# EAGLE design Line sensors (EAGLE 9.4.1)
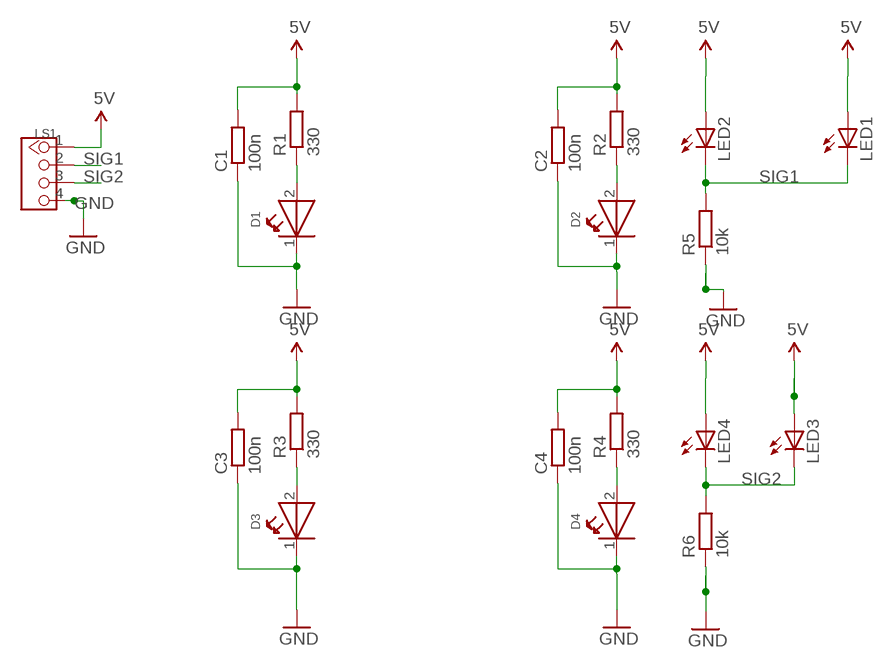
[diagram p0: schematic, sheet 1]

## Parts
C1  100n  R-EU_M0805  [M0805]
C2  100n  R-EU_M0805  [M0805]
C3  100n  R-EU_M0805  [M0805]
C4  100n  R-EU_M0805  [M0805]
D1  WL-SMTW-150141AS73100-A  [3528-2PIN]
D2  WL-SMTW-150141AS73100-A  [3528-2PIN]
D3  WL-SMTW-150141AS73100-A  [3528-2PIN]
D4  WL-SMTW-150141AS73100-A  [3528-2PIN]
LED1  LED3MM  [LED3MM]
LED2  LED3MM  [LED3MM]
LED3  LED3MM  [LED3MM]
LED4  LED3MM  [LED3MM]
LS1  TWIG-4P-2.0-2.0  [4P-2.0]
R1  330  R-EU_M0805  [M0805]
R2  330  R-EU_M0805  [M0805]
R3  330  R-EU_M0805  [M0805]
R4  330  R-EU_M0805  [M0805]
R5  10k  R-EU_M0805  [M0805]
R6  10k  R-EU_M0805  [M0805]

## Nets
5V: C1.2 C2.2 C3.2 C4.2 LED1.A LED2.A LED3.A LED4.A LS1.1 R1.2 R2.2 R3.2 R4.2
GND: C1.1 C2.1 C3.1 C4.1 D1.1(K) D2.1(K) D3.1(K) D4.1(K) LS1.4 R5.1 R6.1
N$3: D1.2(A) R1.1
N$4: D2.2(A) R2.1
N$13: D3.2(A) R3.1
N$16: D4.2(A) R4.1
SIG1: LED1.K(C) LED2.K(C) LS1.2 R5.2
SIG2: LED3.K(C) LED4.K(C) LS1.3 R6.2

## Library data of the parts
C1-C4 R1-R6 = resistor:R-EU_: RESISTOR, European symbol
D1-D4 = Wurth_Elektronik_Optoelectronics_rev15b:WL-SMTW: SMD Side view mono-color round Characteristics Low power consumption High reliability Low current requirement No UV/IR radiation Wide viewing angle Excelllent for edge lighting displays and backlighting indicators Ideal for miniature applications PBC high-usage Compatible with automatic placement equipment Applications Backlighting for LCD Sidelighting applications Indicator and backlighting for telecommunication Backlighting for symbol, switch and dashboard General use <http://katalog.we-online.de/media/images/eipal/WL-SMTW_pf2.jpg> Details see: http://katalog.we-online.de/en/led/WL-SMTW?m Updated: 2015-04-10 2015 (C) Wurth Elektronik; COMPANY-URL: http://www.we-online.de; CREATED-BY: Christin Otto; CREATED-DATE: APR 2013; DATASHEET-URL: http://katalog.we-online.de/en/led/WL-SMTW?m=t&sq=smtw&sp=&sp=http%3A%2F%2Fwww.we-online.de%2Fweb%2Fen%2Felectronic_components%2Fsearchpage_PBS.php%3Fsearch%3Dsmtw; MANUFACTURER: Würth Elektronik eiSos GmbH
LED1-LED4 = SparkFun:LED: LEDs Standard schematic elements and footprints for 5mm, 3mm, 1206, and 0603 sized LEDs. 5mm - Spark Fun Electronics SKU : COM-00529 (and others)
LS1 = Connector:TWIG-4P-2.0

## Board
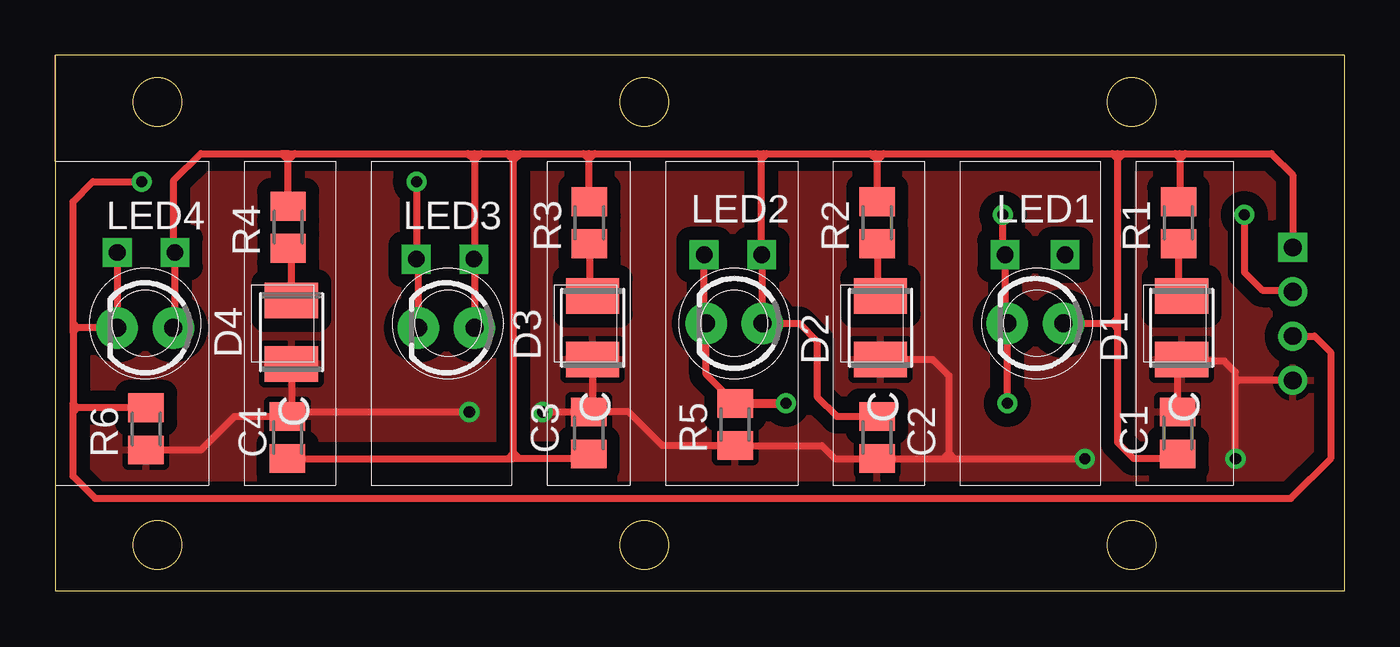
[diagram p1: board, top side]
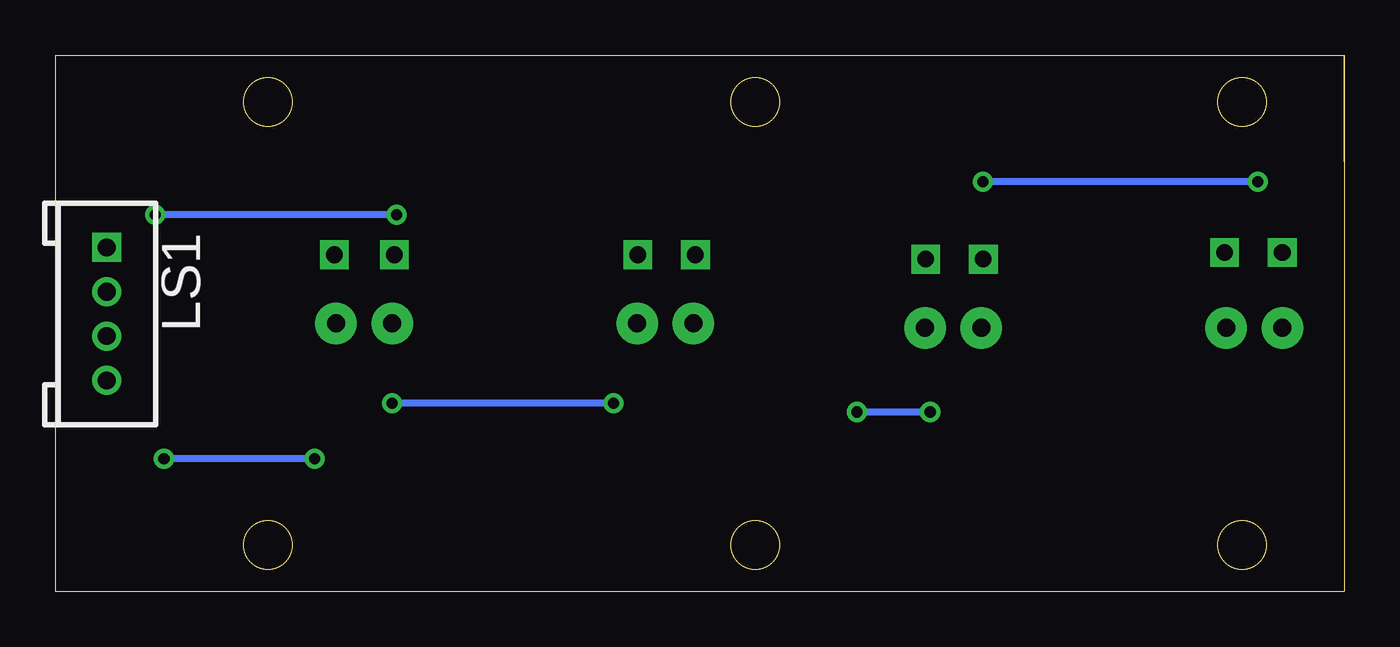
[diagram p2: board, bottom side, seen from below]

Size 58.2 x 24.19 mm. Coordinates in mm from the lower left corner, seen from the top.
Outline: 0,0 58.2,0 58.2,24.19 0,24.19
Outline: 0,24.19 0,0
Outline: 0,19.41 0,24.19
Outline: 53.2,0 0,0
Outline: 53.2,24.19 0,24.19
Outline: circle at 4.6,2.09 radius 1.1
Outline: circle at 48.6,22.09 radius 1.1
Outline: circle at 26.6,22.09 radius 1.1
Outline: circle at 4.6,22.09 radius 1.1
Outline: circle at 48.6,2.09 radius 1.1
Outline: circle at 26.6,2.09 radius 1.1
Outline: circle at 4.6,2.09 radius 1.1
Outline: circle at 4.6,22.09 radius 1.1
Outline: circle at 4.6,2.09 radius 1.1
Outline: circle at 48.6,22.09 radius 1.1
Outline: circle at 26.6,22.09 radius 1.1
Outline: circle at 4.6,22.09 radius 1.1
Outline: circle at 48.6,2.09 radius 1.1
Outline: circle at 26.6,2.09 radius 1.1
Outline: circle at 4.6,2.09 radius 1.1
Outline: circle at 48.6,22.09 radius 1.1
Outline: circle at 26.6,22.09 radius 1.1
Outline: circle at 4.6,22.09 radius 1.1
Outline: circle at 48.6,2.09 radius 1.1
Outline: circle at 26.6,2.09 radius 1.1
Copper layers (1*16): Top 0.035mm / dielectric 1.5mm / Bottom 0.035mm
Design rules "default": minimum track width 10mil, minimum drill 24mil, track to track 8mil, track to pad 8mil, pad to pad 8mil, via to via 8mil, smd to smd 8mil, copper to edge 40mil, drill to drill 8mil, minimum pad ring 10mil, minimum via ring 8mil, stop-mask expansion 4mil, vias tented up to drill 0mil, thermal gap 10mil

### Footprints (pad centres in the part's own frame; a part is rotated, then mirrored left to right if it is on the bottom)
M0805 = smd 1.3 x 1.6: 1 -0.95,0; 2 0.95,0
3528-2PIN = smd 1.6 x 2.4: 1 -1.425,0; 2 1.425,0
LED3MM = drill 0.813 pad 1.88: A -1.27,0; K 1.27,0
4P-2.0 = drill 0.8 pad 1.27 square: 1 -3,0 | drill 0.8 pad 1.27: 2 -1,0; 3 1,0; 4 3,0

### Placement (x,y rotation side)
C1  50.69,7.14 270 top
C2  37.1,6.94 90 top
C3  24.09,7.14 270 top
C4  10.49,6.94 270 top
D1  50.86,11.89 90 top
D2  37.26,11.89 90 top
D3  24.26,11.89 90 top
D4  10.66,11.69 90 top
LED1  44.26,12.09 180 top
LED2  30.66,12.09 180 top
LED3  17.66,11.89 180 top
LED4  4.06,11.89 180 top
LS1  55.88,12.52 270 bottom
R1  50.71,16.64 90 top
R2  37.11,16.64 90 top
R3  24.11,16.64 90 top
R4  10.51,16.44 90 top
R5  30.7,7.53 90 top
R6  4.1,7.33 90 top

### Tracks (layer width: path | path; a pad name or v marks a point on that pad's centre or on a via)
5V  (via drill 0.75 pad 1.3)
  Top 0.305: R1.2 50.8,17.67 50.8,19.53 | 20.7,19.76 21,19.76 | 21,19.76 23.85,19.76 | 23.85,19.76 24.1,19.76 | 24.1,19.76 24.35,19.76 | 24.35,19.76 31.72,19.76 | 31.72,19.76 32,19.76 | 18.93,19.76 18.93,19.46 | 18.93,19.76 19.23,19.76 | 19.23,19.76 20.39,19.76 | 20.39,19.76 20.7,19.76 | R4.2 10.51,19.46 | 10.51,19.46 10.51,19.76 | 10.51,19.76 10.82,19.76 | 10.82,19.76 18.63,19.76 | 18.63,19.76 18.93,19.76 | 31.93,19.55 31.93,19.69 32,19.76 | C4.2 20.44,5.99 | 20.44,5.99 20.7,5.99 | 20.95,5.99 23.89,5.99 C3.2 | 20.95,5.99 20.7,5.99 | 20.7,19.76 20.7,19.46 | 20.7,5.99 20.7,6.25 | 20.7,6.25 20.7,19.46 | C2.2 35.3,7.89 34.4,8.79 34.4,11.29 33.59,12.09 LED2.A 31.93,15.16 v31.9,15.19 31.9,19.52 31.93,19.55 | C1.2 50.49,5.99 48.7,5.99 47.98,6.71 47.98,11.84 | 10.51,19.76 10.21,19.76 | 10.21,19.76 6.56,19.76 5.33,18.52 5.33,15.36 v5.4,15.29 5.4,11.96 LED4.A | 32,19.76 32.14,19.76 | 32.14,19.76 36.81,19.76 | 36.81,19.76 37.05,19.76 | 37.05,19.76 37.42,19.76 | 37.42,19.76 47.72,19.76 | 47.72,19.76 47.98,19.76 | 47.98,19.76 48.23,19.76 | 48.23,19.76 50.57,19.76 | 50.57,19.76 50.77,19.76 | 50.77,19.76 51.02,19.76 | 51.02,19.76 54.91,19.76 55.88,18.8 LS1.1 | 50.77,19.76 50.8,19.73 50.8,19.53 | 51.02,19.76 50.8,19.53 | 50.57,19.76 50.8,19.53 | 47.98,11.84 47.98,12.09 | 47.98,12.09 47.98,12.35 | 47.98,12.35 47.98,19.51 | 47.98,19.51 47.98,19.76 | 47.72,19.76 47.98,19.51 | 48.23,19.76 47.98,19.51 | R2.2 37.11,19.46 | 37.11,19.46 37.11,19.7 37.05,19.76 | 37.11,19.46 36.81,19.76 | 37.11,19.46 37.42,19.76 | 31.72,19.76 31.93,19.55 | 31.93,19.55 32.14,19.76 | R3.2 24.1,17.6 24.1,19.51 | 24.1,19.51 24.1,19.76 | 23.85,19.76 24.1,19.51 | 24.1,19.51 24.35,19.76 | 18.93,19.46 18.63,19.76
  Top 0.305: 18.93,19.46 19.23,19.76 | 20.39,19.76 20.7,19.46 | 20.7,19.46 21,19.76 | 10.21,19.76 10.51,19.46 | 10.51,19.46 10.82,19.76 | 20.44,5.99 20.7,6.25 | 20.95,5.99 20.7,6.25 | LED1.A 47.72,12.09 | 47.72,12.09 47.97,12.09 47.98,12.09 | 47.98,12.35 47.72,12.09 | 47.72,12.09 47.98,11.84 | 18.93,19.46 18.93,15.02 v18.9,14.99 18.93,14.96 LED3.A
  Top 0.406: C2.2
GND  (via drill 0.5)
  Top 0.305: D3.1 24.26,8.27 C3.1 | C1.1 50.69,10.29 D1.1 50.94,10.39 52.8,10.39 53.3,9.89 53.3,9.39 | D4.1 10.66,8.07 C4.1 8.1,7.89 6.58,6.38 R6.1 | C3.1 25.89,8.09 27.41,6.58 R5.1 34.61,6.58 35.2,5.99 C2.1 40.1,5.99 | D2.1 39.62,10.47 40.36,9.73 40.36,6.24 | v18.7,8.09 10.69,8.09 | v22,8.09 C3.1 | v53.3,5.99 53.3,9.39 | LS1.4 53.42,9.52 53.3,9.39 | v46.5,5.99 v46.49,5.99 40.61,5.99 | 40.1,5.99 40.36,5.99 | 40.36,5.99 40.61,5.99 | 40.36,6.24 40.36,5.99 | 40.1,5.99 40.36,6.24 | 40.36,6.24 40.61,5.99
  Top 0.406: v22,8.09 | 10.69,8.09 C4.1
  Bottom 0.305: v18.7,8.09 v22,8.09 | v46.5,5.99 v53.3,5.99
  pour Top (isolate 0.61): -0.58,24.79 59.46,24.7 59.46,-0.84 -0.58,-0.74
N$3
  Top 0.305: R1.1 50.71,13.47 D1.2
N$4
  Top 0.305: R2.1 37.11,13.47 D2.2
N$13
  Top 0.305: R3.1 24.11,13.47 D3.2
N$16
  Top 0.305: D4.2 10.66,15.34 R4.1
N$22  (via drill 0.75 pad 1.3)
  other vias: 45.6,15.19
SIG1  (via drill 0.5, 0.75 pad 1.3)
  Top 0.305: R5.2 29.39,9.79 LED2.K 29.3,12.18 v29.3,15.19 | v43,8.49 LED1.K | v53.7,16.99 53.7,14.39 54.5,13.59 55.8,13.59 LS1.2 | LED1.K 42.9,12.18 v42.9,15.19 42.8,15.29 v42.8,16.99
  Top 0.406: R5.2 32.98,8.48 v33,8.49 | LED1.K
  Bottom 0.305: v33,8.49 v43,8.49 | v42.8,16.99 v53.7,16.99
SIG2  (via drill 0.5, 0.75 pad 1.3)
  Top 0.305: LS1.3 56.87,11.52 57.6,10.79 57.6,5.99 55.8,4.19 1.8,4.19 0.8,5.19 0.8,8.09 | 0.8,8.09 0.8,8.29 | 0.8,8.29 0.8,8.47 | 0.8,11.7 0.8,8.47 | 0.8,11.7 0.8,11.89 | 0.8,11.89 0.8,12.09 | 0.8,12.09 0.8,17.59 1.7,18.49 v3.9,18.49 | R6.2 0.99,8.28 | 0.99,8.28 0.81,8.28 0.8,8.29 | 0.8,11.89 | 0.99,11.89 LED4.K v2.8,15.29 | 0.8,11.89 0.99,11.89 | 0.8,12.09 0.99,11.9 0.99,11.89 | 0.8,11.7 0.99,11.89 | 0.8,8.47 0.99,8.28 | 0.99,8.28 0.8,8.09 | 16.3,18.46 v16.32,18.49 16.32,15.02 v16.3,14.99 16.39,14.9 LED3.K
  Bottom 0.305: v3.9,18.49 v16.32,18.49